# Altium schematic sheet clock-temp-touch-sw.SchDoc
size A3; SPICEModelCacheRLVYLVLF: <root> / <DocumentId>RLVYLVLF</DocumentId> / <CacheFrame Number="0"> / <Model Name="dtunnel1" Kind="CKT"> / <Text>*Tunnel Diode Default / *MCE 600V 50A 27.2ns default parameters / *Diode Pinout: A,K / * Parameters: / * RS:  Series resistance value / * RP:  Negative resistance value in parallel with capacitance. / * CP:   Capacitance value in parallel with negative resistance. / * LS:  Series inductance value. / * / * / .SUBCKT DTUNNEL1 1 2 PARAMS: Rs=6 Rp=-75 Cp=0.6E-12 Ls=0.1nH / RS  1 3  {Rs} / RP  3 4  {Rp} / CP  3 4  {Cp} / LS  4 2  {Ls} / .ENDS DTUNNEL1</Text> / </Model> / </CacheFrame> / </root>
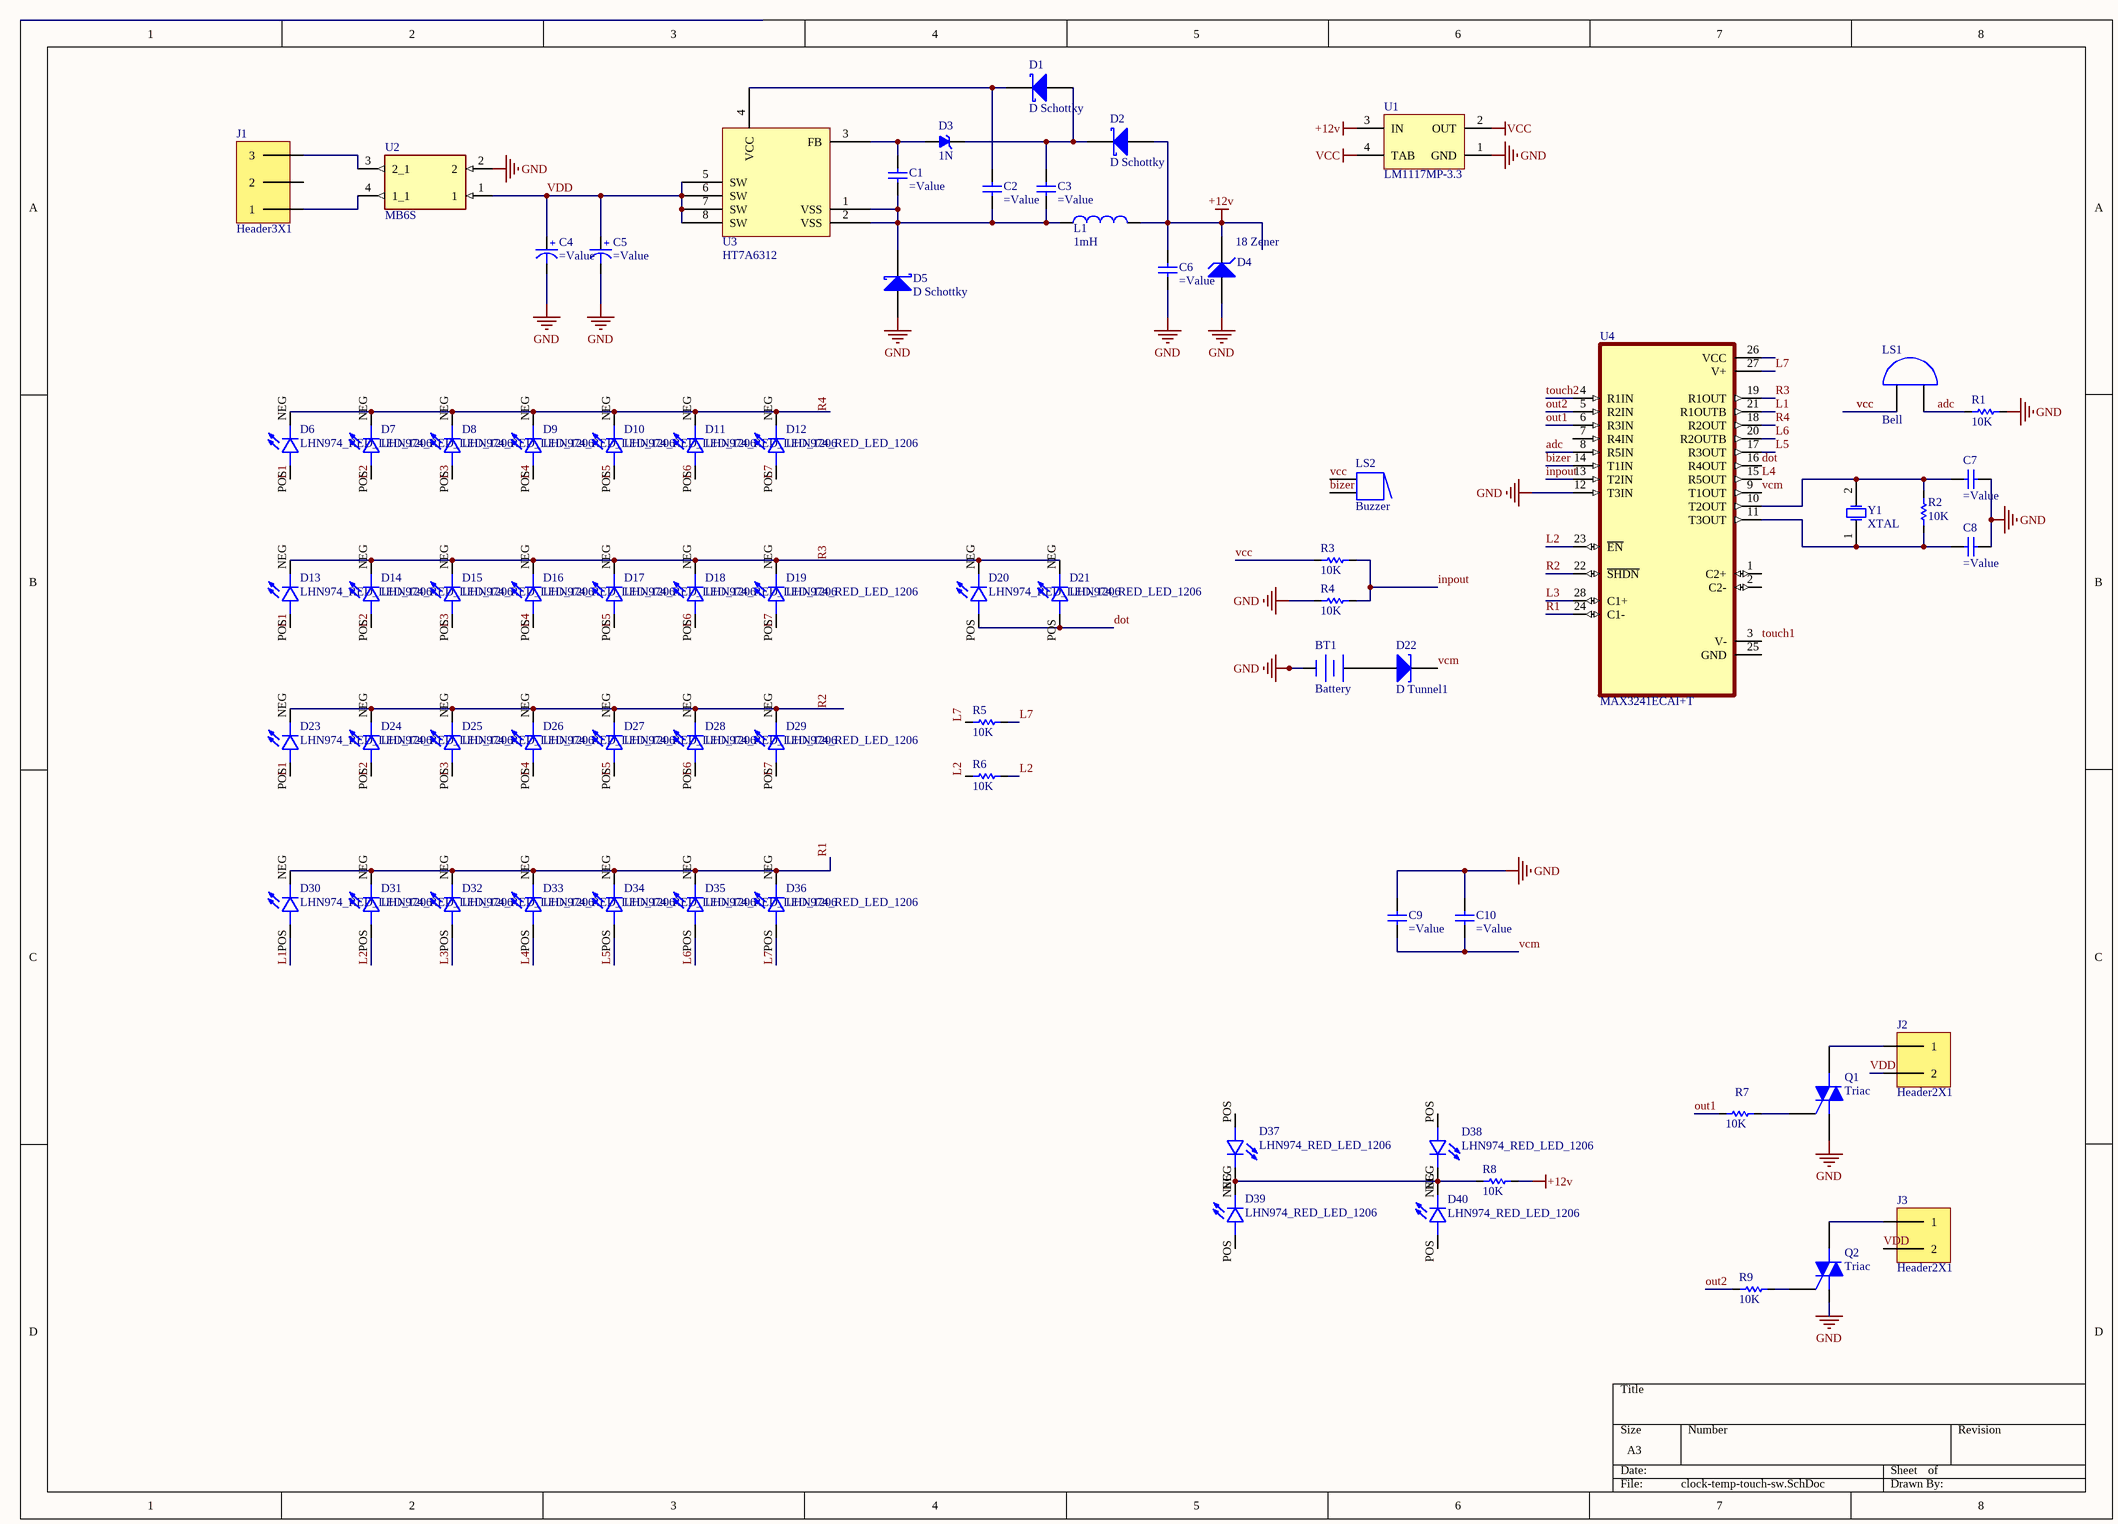
[diagram p0: clock-temp-touch-sw.SchDoc]

## Parts
BT1  Battery  [BAT-2]
C1  (no value)  [CAP 1206]
C2  (no value)  [CAP 1206]
C3  (no value)  [CAP 1206]
C4  (no value)  [ELEC-CAP-RAD15-30]
C5  (no value)  [ELEC-CAP-RAD15-30]
C6  (no value)  [CAP 1206]
C7  (no value)  [CAP 1206]
C8  (no value)  [CAP 1206]
C9  (no value)  [CAP 1206]
C10  (no value)  [CAP 1206]
D1  D Schottky  [SMB]
D2  D Schottky  [SMB]
D3  MODEL: 1N  [DO-35]  (hidden comment: Zener Diode)
D4  18 Zener  [minimelf]
D5  D Schottky  [SMB]
D6  LHN974_RED_LED_1206  [LEDC3216X120N]
D7  LHN974_RED_LED_1206  [LEDC3216X120N]
D8  LHN974_RED_LED_1206  [LEDC3216X120N]
D9  LHN974_RED_LED_1206  [LEDC3216X120N]
D10  LHN974_RED_LED_1206  [LEDC3216X120N]
D11  LHN974_RED_LED_1206  [LEDC3216X120N]
D12  LHN974_RED_LED_1206  [LEDC3216X120N]
D13  LHN974_RED_LED_1206  [LEDC3216X120N]
D14  LHN974_RED_LED_1206  [LEDC3216X120N]
D15  LHN974_RED_LED_1206  [LEDC3216X120N]
D16  LHN974_RED_LED_1206  [LEDC3216X120N]
D17  LHN974_RED_LED_1206  [LEDC3216X120N]
D18  LHN974_RED_LED_1206  [LEDC3216X120N]
D19  LHN974_RED_LED_1206  [LEDC3216X120N]
D20  LHN974_RED_LED_1206  [LEDC3216X120N]
D21  LHN974_RED_LED_1206  [LEDC3216X120N]
D22  D Tunnel1  [3.2X1.6X1.1]
D23  LHN974_RED_LED_1206  [LEDC3216X120N]
D24  LHN974_RED_LED_1206  [LEDC3216X120N]
D25  LHN974_RED_LED_1206  [LEDC3216X120N]
D26  LHN974_RED_LED_1206  [LEDC3216X120N]
D27  LHN974_RED_LED_1206  [LEDC3216X120N]
D28  LHN974_RED_LED_1206  [LEDC3216X120N]
D29  LHN974_RED_LED_1206  [LEDC3216X120N]
D30  LHN974_RED_LED_1206  [LEDC3216X120N]
D31  LHN974_RED_LED_1206  [LEDC3216X120N]
D32  LHN974_RED_LED_1206  [LEDC3216X120N]
D33  LHN974_RED_LED_1206  [LEDC3216X120N]
D34  LHN974_RED_LED_1206  [LEDC3216X120N]
D35  LHN974_RED_LED_1206  [LEDC3216X120N]
D36  LHN974_RED_LED_1206  [LEDC3216X120N]
D37  LHN974_RED_LED_1206  [LEDC3216X120N]
D38  LHN974_RED_LED_1206  [LEDC3216X120N]
D39  LHN974_RED_LED_1206  [LEDC3216X120N]
D40  LHN974_RED_LED_1206  [LEDC3216X120N]
J1  Header3X1  [HEADER 3X1]
J2  Header2X1  [Header 2X1]
J3  Header2X1  [Header 2X1]
L1  1mH  [HS1101]
LS1  Bell  [PIN2]
LS2  Buzzer  [ABSM-1574]
Q1  Triac  [SOT89N]
Q2  Triac  [SOT89N]
R1  10K  [RES 1206 (3216X08L)]
R2  10K  [RES 1206 (3216X08L)]
R3  10K  [RES 1206 (3216X08L)]
R4  10K  [RES 1206 (3216X08L)]
R5  10K  [RES 1206 (3216X08L)]
R6  10K  [RES 1206 (3216X08L)]
R7  10K  [RES 1206 (3216X08L)]
R8  10K  [RES 1206 (3216X08L)]
R9  10K  [RES 1206 (3216X08L)]
U1  LM1117MP-3.3  [MP04A_N]
U2  MB6S  [SOIC245P670X270-4N]
U3  HT7A6312  [SOIC127P599X175-8N]
U4  MAX3241ECAI+T  [SOP65P777X199-28N]
Y1  XTAL  [R38]

## Nets
+12v: C6.1(+) D2.1(A) D4.2(K) L1.2 R8.1 U1.3(IN)
GND: BT1.2(-) C4.1(-) C5.1(-) C6.2(-) C7.1(+) C8.1(+) C9.2(-) C10.2(-) D4.1(A) D5.1(A) Q1.1(M1) Q2.1(M1) R1.1 R4.2 U1.1(GND) U2.2 U4.12(T3IN)
vcc: LS1.1(A) LS2.1 LS2.1A R3.2 U1.2(OUT) U1.4(TAB)
adc: LS1.2(B) R1.2 U4.8(R5IN)
bizer: LS2.2 LS2.2A U4.14(T1IN)
dot: D20.POS D21.POS U4.16(R4OUT)
inpout: R3.1 R4.1 U4.13(T2IN)
L1: D6.POS D13.POS D23.POS D30.POS U4.21(R1OUTB)
L2: D7.POS D14.POS D24.POS D31.POS R6.1 R6.2 U4.23(~{EN})
L3: D8.POS D15.POS D25.POS D32.POS U4.28(C1+)
L4: D9.POS D16.POS D26.POS D33.POS U4.15(R5OUT)
L5: D10.POS D17.POS D27.POS D34.POS U4.17(R3OUT)
L6: D11.POS D18.POS D28.POS D35.POS U4.20(R2OUTB)
L7: D12.POS D19.POS D29.POS D36.POS R5.1 R5.2 U4.27(V+)
out1: R7.1 U4.6(R3IN)
out2: R9.1 U4.5(R2IN)
R1: D30.NEG D31.NEG D32.NEG D33.NEG D34.NEG D35.NEG D36.NEG U4.24(C1-)
R2: D23.NEG D24.NEG D25.NEG D26.NEG D27.NEG D28.NEG D29.NEG U4.22(~{SHDN})
R3: D13.NEG D14.NEG D15.NEG D16.NEG D17.NEG D18.NEG D19.NEG D20.NEG D21.NEG U4.19(R1OUT)
R4: D6.NEG D7.NEG D8.NEG D9.NEG D10.NEG D11.NEG D12.NEG U4.18(R2OUT)
touch1: U4.3(V-)
touch2: U4.4(R1IN)
vcm: C9.1(+) C10.1(+) D22.2(K) U4.9(T1OUT)
VDD: C4.2(+) C5.2(+) J2.2 J3.2 U2.1 U3.5(SW) U3.6(SW) U3.7(SW) U3.8(SW)
NetBT1_1: BT1.1(+) D22.1(A)
NetC1_1: C1.1(+) D3.1(A) U3.3(FB)
NetC1_2: C1.2(-) C2.2(-) C3.2(-) D5.2(K) L1.1 U3.1(VSS) U3.2(VSS)
NetC2_1: C2.1(+) D1.2(K) U3.4(VCC)
NetC3_1: C3.1(+) D1.1(A) D2.2(K) D3.2(K)
NetC7_2: C7.2(-) R2.2 U4.10(T2OUT) Y1.2(OSC2)
NetC8_2: C8.2(-) R2.1 U4.11(T3OUT) Y1.1(OSC1)
NetD37_NEG: D37.NEG D38.NEG D39.NEG D40.NEG R8.2
NetJ1_1: J1.1 U2.4(1_1)
NetJ1_3: J1.3 U2.3(2_1)
NetJ2_1: J2.1 Q1.2(M2)
NetJ3_1: J3.1 Q2.2(M2)
NetQ1_3: Q1.3(G) R7.2
NetQ2_3: Q2.3(G) R9.2

Not connected (* = marked no-connect by the designer): D37 POS; D38 POS; D39 POS; D40 POS; J1 2; U4 1(C2+) 2(C2-) 7(R4IN) 25(GND) 26(VCC)

## Library data of the parts
BT1 = Battery: Multicell Battery; Published: 24-Mar-1999; LatestRevisionDate: 17-Jul-2002; LatestRevisionNote: Re-released for DXP Platform.; PackageReference: BAT-2; Publisher: Altium Limited; PackageDescription: Battery; 2 Leads
C1-C3 C6-C10 = Capacitor
C4 C5 = Capacitor Electrolytic: Electrolytic Capacitor
D1 D2 D5 = D Schottky: Schottky Diode; Published: 8-Jun-2000; LatestRevisionDate: 17-Jul-2002; LatestRevisionNote: Re-released for DXP Platform.; PackageReference: SMB; Publisher: Altium Limited; PackageDescription: DO-214-AA/SMB; 2 C-Bend Leads; Body 5.3 x 3.6 mm, inc. leads (LxW); Code_JEDEC: DO-214-AA
D4 = D Zener: Zener Diode; Published: 8-Jun-2000; LatestRevisionDate: 17-Jul-2002; LatestRevisionNote: Re-released for DXP Platform.; PackageReference: DIODE-0.7; Publisher: Altium Limited
D6-D21 D23-D40 = LHN974_RED_LED_1206: 2.6 V Red LED SMD; MP: LHN974 RED LED 1206; MF: Osram; SnapEDA_Link: https://www.snapeda.com/parts/LHN974%20RED%20LED%201206/Osram/view-part/7899607/?ref=snap; Availability: Not in stock; Price: None; Check_prices: https://www.snapeda.com/parts/LHN974%20RED%20LED%201206/Osram/view-part/7899607/?ref=eda; Value: *; Package: None
D22 = D Tunnel1: Tunnel Diode - RLC Model; Published: 8-Jun-2000; LatestRevisionDate: 17-Jul-2002; LatestRevisionNote: Re-released for DXP Platform.; PackageVersion: Feb-2002; PackageReference: 3.2X1.6X1.1; Publisher: Altium Limited; PackageDescription: SM LED; 2 Flat Leads
L1 = Inductor: Code_IEC: 1005; Published: 8-Jun-2000; LatestRevisionDate: 17-Jul-2002; LatestRevisionNote: Re-released for DXP Platform.; PackageReference: 0402-A; Publisher: Altium Limited; Code_JEITA: 0402; Value: 1mH
LS1 = Bell: Electrical Bell; Published: 24-Mar-1999; LatestRevisionDate: 17-Jul-2002; LatestRevisionNote: Re-released for DXP Platform.; PackageReference: PIN2; Publisher: Altium Limited
LS2 = Buzzer: Magnetic Transducer Buzzer; Published: 24-Mar-1999; LatestRevisionDate: 17-Dec-2003; LatestRevisionNote: Schematic revised, PCB Footprint replaced.; DatasheetVersion: 17-Dec-2003; PackageReference: ABSM-1574; Publisher: Altium Limited; PackageDescription: Magnetic Transducer Buzzer; ComponentLink1Description: Manufacturer Link; ComponentLink1URL: http://www.megastar.com/linecard/buzzmode/index.php
Q1 Q2 = Triac: Silicon Bidirectional Triode Thyristor; pin to pad: 1>3 3>1; Note: Pin 2 is electrically connected to Pin 4 (TAB); Published: 29-Sep-2000; LatestRevisionDate: 17-Jul-2002; LatestRevisionNote: Re-released for DXP Platform.; DatasheetVersion: 1999; PackageReference: 369-03; Publisher: Altium Limited; PackageDescription: TO, Thru-Hole, Vertical, Heatsink Mounted; 3 In-Line Leads; Pitch 2.28 mm; ComponentLink1Description: Manufacturer Link; ComponentLink1URL: http://www.motorola.com/
R1-R9 = Resistor: Tolerance: 5%; Power: 1/4 W; Value: 10K
U1 = LM1117MP-3.3: 800mA Low-Dropout Linear Regulator; Manufacturer: National Semiconductor; CompType: LDO IC; PackageTopMarking: XYTT*N05A; PowerWise: N; Published: 4-Dec-2008; DatasheetVersion: Apr-2006; PackageVersion: revB, Apr-2003; PackageReference: MP04A; Publisher: Altium Limited; PackageDescription: Molded SOT-223, 6.50 x 3.56 x 1.6mm Body, 4 Lead, 2.3mm Pitch; PartNumber: LM1117MP-3.3; RoHS: O; PinCount: 4; DigiKeyPartNumber: LM1117MP-3.3CT-ND; Code_JEDEC: TO-261-AA; Code_IPC: SOT223-4; ComponentLink1Description: LM1117 Datasheet; ComponentLink1URL: http://www.national.com/ds/LM/LM1117.pdf; ComponentLink2Description: LM1117 Web Page; ComponentLink2URL: http://www.national.com/pf/LM/LM1117.html; ComponentLink3Description: MP04A Package Page; ComponentLink3URL: http://www.national.com/packaging/folders/mp04a.html
U2 = MB6S: Bridge Rectifier Single Phase Standard 600V Surface Mount 4-SOIC; MF: ON Semiconductor; Digi-Key_Purchase_URL: https://www.digikey.com.tr/product-detail/en/on-semiconductor/MB6S/MB6SCT-ND/965654?utm_source=snapeda&utm_medium=aggregator&utm_campaign=symbol; Value: *; Package: BESOP-4 Surge Components; Digi-Key_Part_Number: MB6SCT-ND; SnapEDA_Link: https://www.snapeda.com/parts/MB6S/ON%20Semiconductor/view-part/2774209/?ref=snap; MP: MB6S
U3 = Component_1
U4 = MAX3241ECAI+T: ±15kV ESD-Protected, Down to 10nA, 3.0V to 5.5V, Up to 1Mbps, True RS-232 Transceivers; MF: Analog Devices; SnapEDA_Link: https://www.snapeda.com/parts/MAX3241ECAI+T/Analog+Devices/view-part/?ref=snap; Package: SSOP-28 Maxim; Value: *; MP: MAX3241ECAI+T; Check_prices: https://www.snapeda.com/parts/MAX3241ECAI+T/Analog+Devices/view-part/?ref=eda
Y1 = XTAL: Crystal Oscillator; Published: 8-Jun-2000; LatestRevisionDate: 17-Jul-2002; LatestRevisionNote: Re-released for DXP Platform.; PackageReference: R38; Publisher: Altium Limited; PackageDescription: Crystal, Thru-Hole; 2 Leads; Body 3.1 x 8.2 mm (Dia.xH)